# Altium schematic sheet Relay.SchDoc
size A
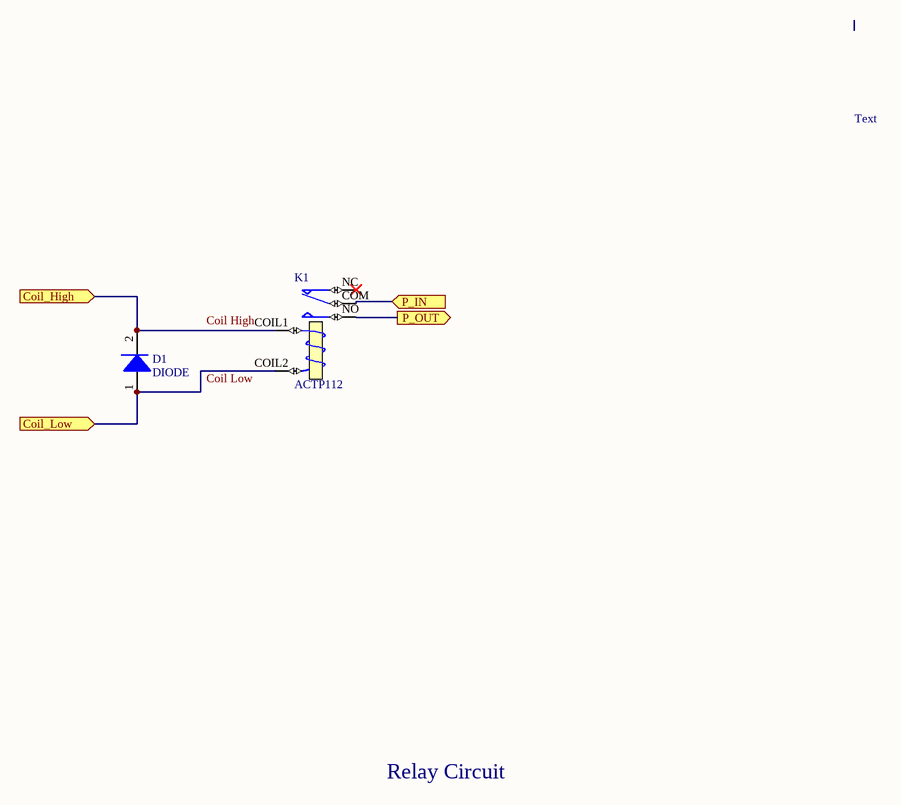
[diagram p0: Relay.SchDoc]

## Parts
D1  DIODE  [SOD123F]
K1  ACTP112  [ACTP112]

## Ports
Coil_High (in), Coil_Low (in), P_IN (in), P_OUT (out)

## Nets
Coil_High: D1.2(K) K1.COIL1(T1) ; port Coil_High
Coil_Low: D1.1(A) K1.COIL2(T2) ; port Coil_Low
P_IN: K1.COM ; port P_IN
P_OUT: K1.NO ; port P_OUT

Not connected (* = marked no-connect by the designer): K1 NC*

## Notes on the sheet
- Text
- Relay Circuit
- Labels drawn without touching a wire or pin: Coil High, Coil Low

## Library data of the parts
D1 = 2: Diode Super Barrier 40V 1A Surface Mount SOD-123F; Manufacturer_id: 1; MfrPartNo: 1N5819HW1-7-F; idDiode: 2; Name: 1N5819; Drawer_id: 1; Value: 1A; Type: Super Barrier; Num_Circuits: 1; Ic: 1A; Power: 40V; Package: SOD-123; Link: https://www.digikey.com/product-detail/en/diodes-incorporated/1N5819HW1-7-F/1N5819HW1-7-FDITR-ND/5768523; ComponentLink1Description: Datasheet; ComponentLink1URL: https://www.diodes.com/assets/Datasheets/1N5819HW1.pdf; Supplier1: Digi-Key; Supplier1PartNo: 1N5819HW1-7-FDITR-ND
K1 = 3: Manufacturer_id: 1; idRelay: 3; Coil_Voltage: 12V; Published: 8-Jun-2000; LatestRevisionDate: 17-Jul-2002; LatestRevisionNote: Re-released for DXP Platform.; PackageReference: MODULE5B; Publisher: Altium Limited; Drawer_id: 1; Name: ACTP112